# EAGLE schematic reset (EAGLE 7.3.0)
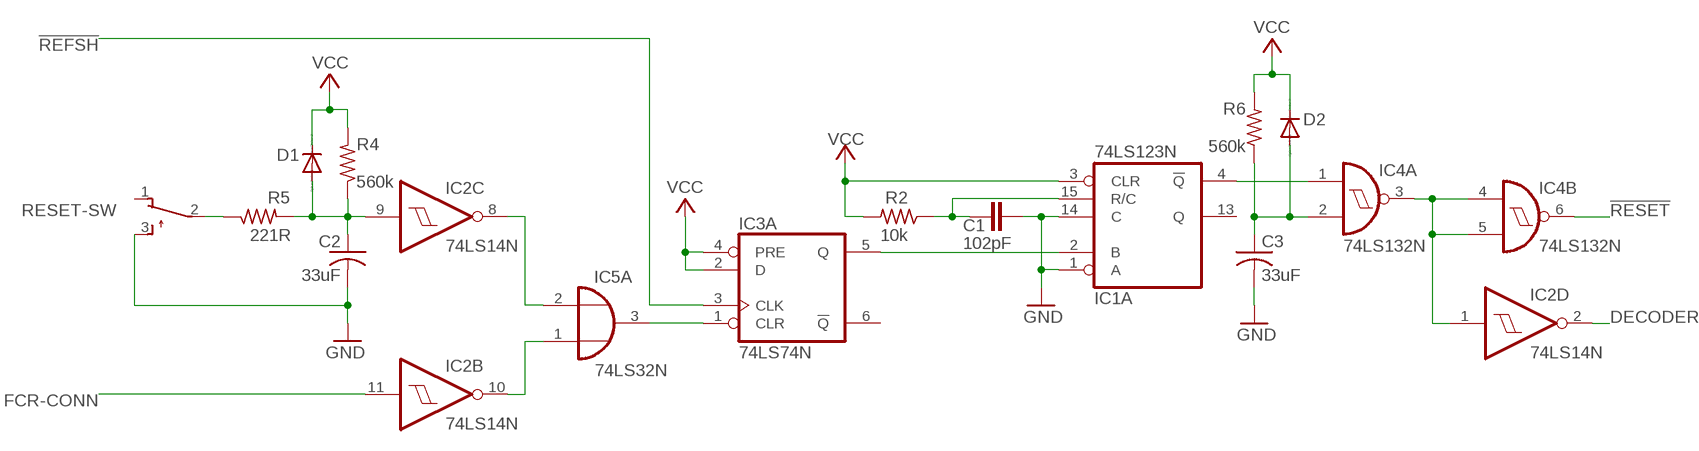
[diagram p0: schematic, sheet 1]

## Parts
C1  102pF  C-EU025-030X050  [C025-030X050]
C2  33uF  C-US025-030X050  [C025-030X050]
C3  33uF  C-US025-030X050  [C025-030X050]
D1  1N4148DO35-10  [DO35-10]
D2  1N4148DO35-10  [DO35-10]
IC1  74LS123N  [DIL16]
IC2  74LS14N  [DIL14]
IC3  74LS74N  [DIL14]
IC4  74LS132N  [DIL14]
IC5  74LS32N  [DIL14]
R2  10k  R-US_0204/7  [0204/7]
R4  560k  R-US_0204/7  [0204/7]
R5  221R  R-US_0204/7  [0204/7]
R6  560k  R-US_0204/7  [0204/7]
RESET-SW  TL32PO  [TL3XPO]

## Nets
!REFSH!: IC3.3(A:CLK)
!RESET!: IC4.6(B:O)
DECODER: IC2.2(D:O)
FCR-CONN: IC2.11(B:I)
GND: C1.1 C2.2 C3.2 IC1.1(A:A) IC1.14(A:C) RESET-SW.3(S)
N$3: IC2.10(B:O) IC5.1(A:I0)
N$4: IC3.1(A:CLR) IC5.3(A:O)
N$5: IC2.8(C:O) IC5.2(A:I1)
N$9: C2.1 D1.A IC2.9(C:I) R4.1 R5.2
N$10: IC1.2(A:B) IC3.5(A:Q)
N$11: C1.2 IC1.15(A:R/C) R2.1
N$12: IC1.4(A:!Q) IC4.1(A:I0)
N$13: R5.1 RESET-SW.2(P)
N$14: C3.1 D2.A IC4.2(A:I1) R6.1
N$16: IC2.1(D:I) IC4.3(A:O) IC4.4(B:I0) IC4.5(B:I1)
VCC: D1.C D2.C IC1.3(A:CLR) IC3.2(A:D) IC3.4(A:PRE) R2.2 R4.2 R6.2
Unconnected: IC1.5(B:Q) IC1.6(B:C) IC1.7(B:R/C) IC1.9(B:A) IC1.10(B:B) IC1.11(B:CLR) IC1.12(B:!Q) IC1.13(A:Q) IC2.3(E:I) IC2.4(E:O) IC2.5(F:I) IC2.6(F:O) IC2.12(A:O) IC2.13(A:I) IC3.6(A:!Q) IC3.8(B:!Q) IC3.9(B:Q) IC3.10(B:PRE) IC3.11(B:CLK) IC3.12(B:D) IC3.13(B:CLR) IC4.8(C:O) IC4.9(C:I0) IC4.10(C:I1) IC4.11(D:O) IC4.12(D:I0) IC4.13(D:I1) IC5.4(B:I0) IC5.5(B:I1) IC5.6(B:O) IC5.8(C:O) IC5.9(C:I0) IC5.10(C:I1) IC5.11(D:O) IC5.12(D:I0) IC5.13(D:I1) RESET-SW.1(O)

## Power pins joined to a net without a drawn wire
GND: IC1.8(P:GND) IC2.7(P:GND) IC3.7(P:GND) IC4.7(P:GND) IC5.7(P:GND)
VCC: IC1.16(P:VCC) IC2.14(P:VCC) IC3.14(P:VCC) IC4.14(P:VCC) IC5.14(P:VCC)

## Library data of the parts
C1 = resistor:C-EU: CAPACITOR, European symbol
C2 C3 = resistor:C-US: CAPACITOR, American symbol
D1 D2 = diode:1N4148: DIODE high speed (Philips)
IC1 = 74xx-eu:74*123: Retriggerable monostable MULTIVIBRATOR
IC2 = 74xx-eu:74*14: Hex schmitt trigger INVERTER
IC3 = 74xx-eu:74*74: Dual D type positive edge triggered FLIP FLOP, preset and clear
IC4 = 74xx-eu:74*132: Quad 2-input NAND schmitt trigger
IC5 = 74xx-eu:74*32: Quad 2-input OR gate
R2 R4-R6 = resistor:R-US_: RESISTOR, American symbol
RESET-SW = switch:TL32PO: TINY SWITCH ON - MOM Source: http://www2.produktinfo.conrad.com/datenblaetter/700000-724999/705152-da-01-de-Subminiaturschalter_TL_36YO.pdf